# Altium schematic sheet DOIBoard3.SchDoc: DOI Board 3
size A4; Revision: V1.0
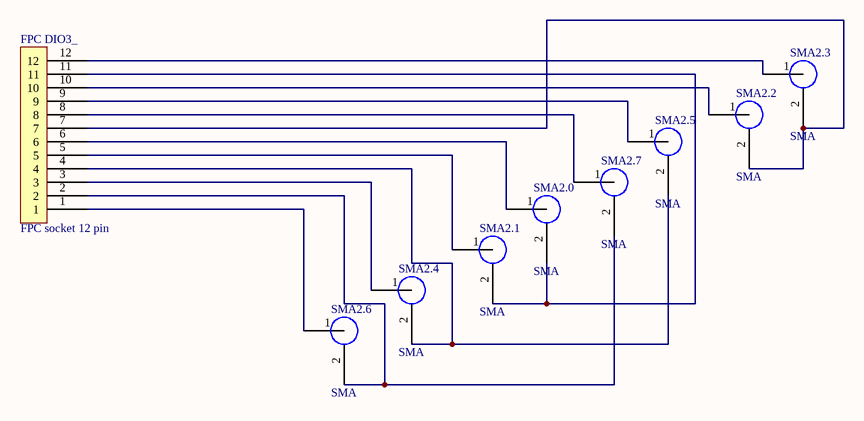
[diagram p0: DOIBoard3.SchDoc]

## Parts
FPC_DIO3_  FPC socket 12 pin  [FPC 12pin]
SMA2.0  SMA  [SMA]
SMA2.1  SMA  [SMA]
SMA2.2  SMA  [SMA]
SMA2.3  SMA  [SMA]
SMA2.4  SMA  [SMA]
SMA2.5  SMA  [SMA]
SMA2.6  SMA  [SMA]
SMA2.7  SMA  [SMA]

## Nets
NetFPC_DIO3__1: FPC_DIO3_.1 SMA2.6.1(Core)
NetFPC_DIO3__2: FPC_DIO3_.2 SMA2.6.2(Ground) SMA2.7.2(Ground)
NetFPC_DIO3__3: FPC_DIO3_.3 SMA2.4.1(Core)
NetFPC_DIO3__4: FPC_DIO3_.4 SMA2.4.2(Ground) SMA2.5.2(Ground)
NetFPC_DIO3__5: FPC_DIO3_.5 SMA2.1.1(Core)
NetFPC_DIO3__6: FPC_DIO3_.6 SMA2.0.1(Core)
NetFPC_DIO3__7: FPC_DIO3_.7 SMA2.2.2(Ground) SMA2.3.2(Ground)
NetFPC_DIO3__8: FPC_DIO3_.8 SMA2.7.1(Core)
NetFPC_DIO3__9: FPC_DIO3_.9 SMA2.5.1(Core)
NetFPC_DIO3__10: FPC_DIO3_.10 SMA2.2.1(Core)
NetFPC_DIO3__11: FPC_DIO3_.11 SMA2.0.2(Ground) SMA2.1.2(Ground)
NetFPC_DIO3__12: FPC_DIO3_.12 SMA2.3.1(Core)

## Notes on the sheet
- Title
- Size:
- Date:
- A4
- Number:
- Time:
- Revision:
- Sheet
- of
- File: